# EAGLE design Multitaskr_Schematic (EAGLE 9.6.2)
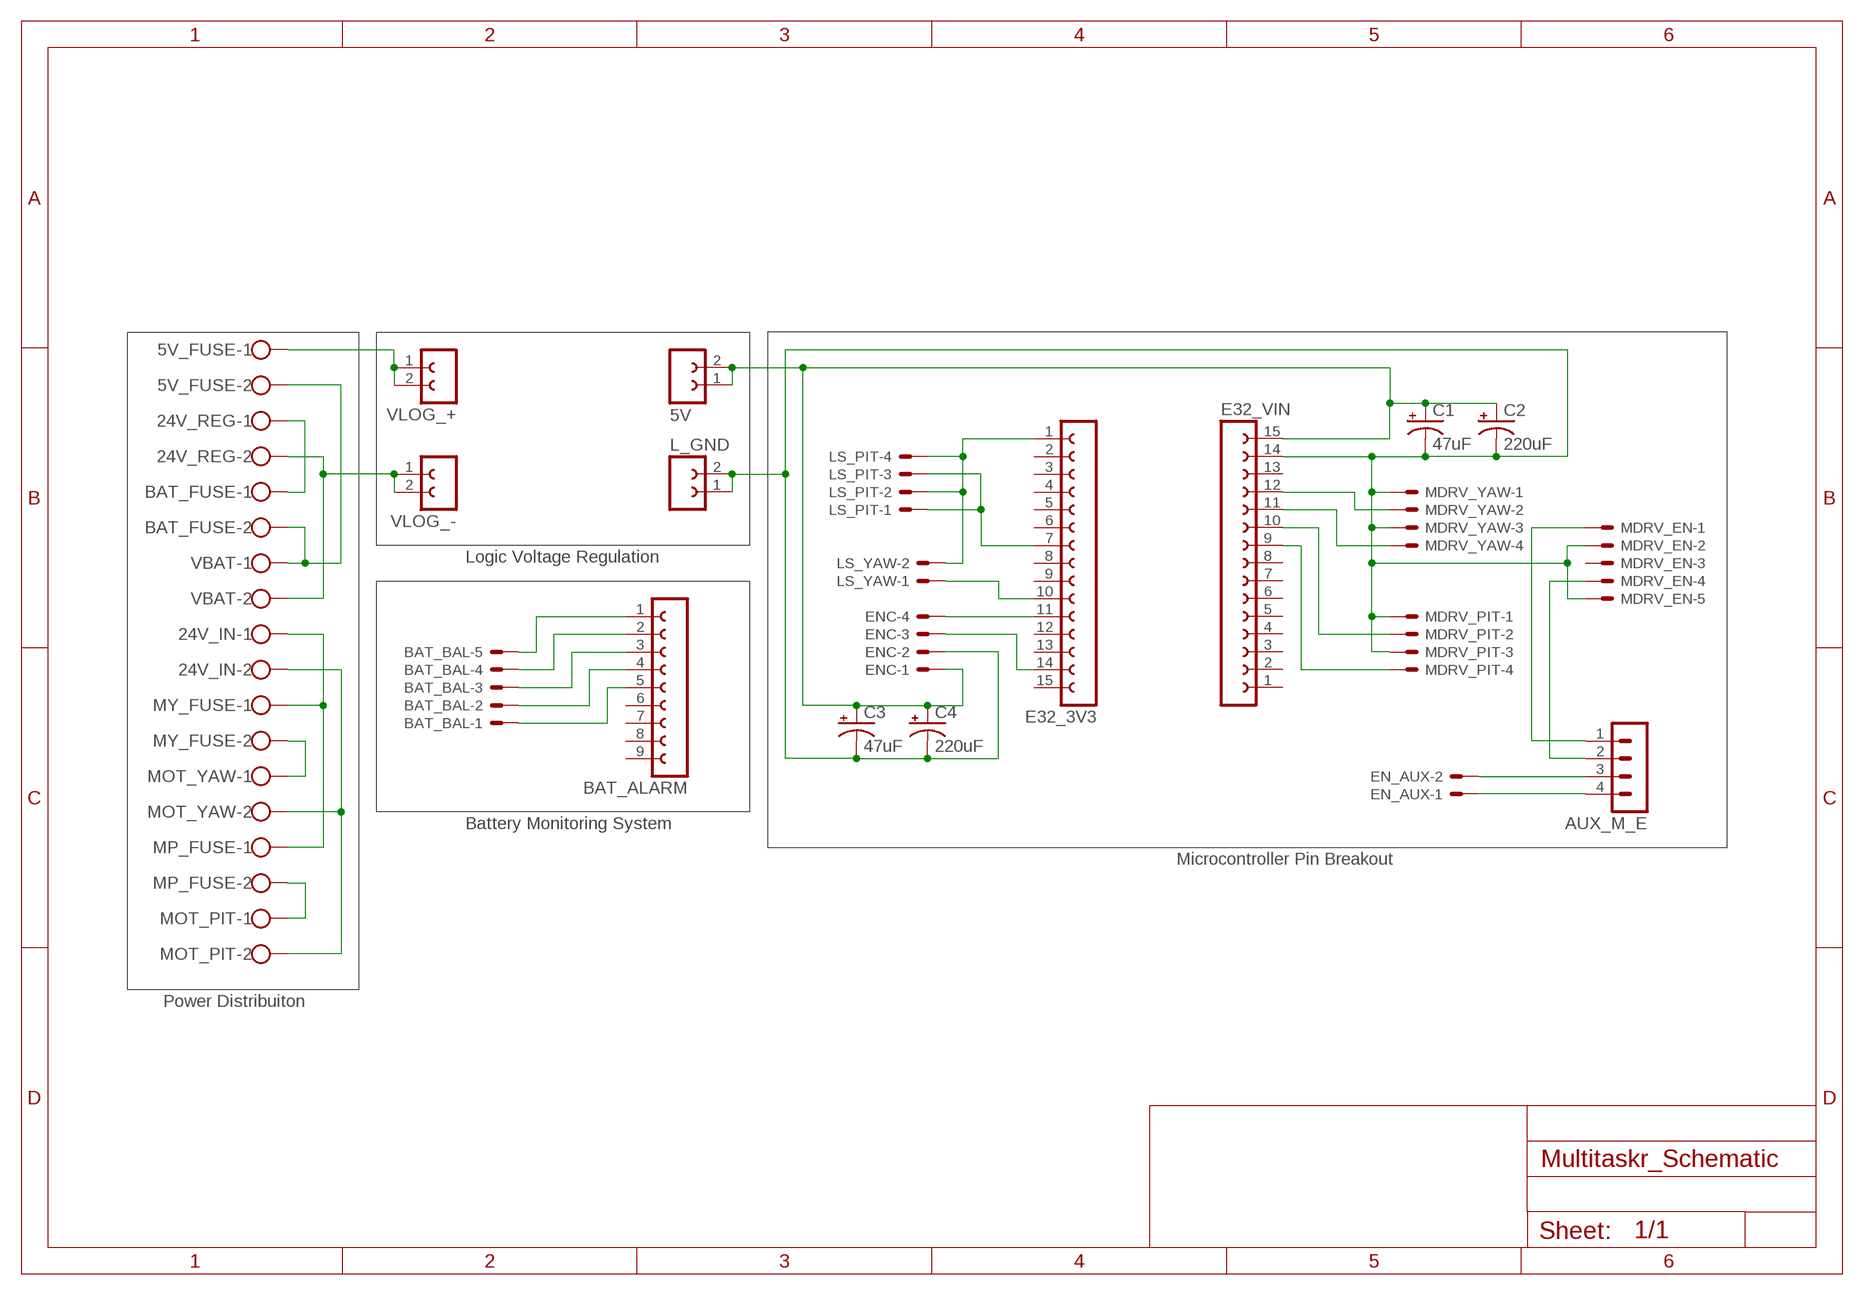
[diagram p0: schematic, sheet 1]

## Parts
5V  FE05-1  [FE05-1]
5V_FUSE  SCREW_TERMINAL  [FP_ST]
24V_IN  SCREW_TERMINAL  [FP_ST]
24V_REG  SCREW_TERMINAL  [FP_ST]
AUX_M_E  MA04-1  [MA04-1]
BAT_ALARM  FE09-1  [FE09]
BAT_BAL  JST-XH-05-PIN-ROUND-PAD  [JST-XH-05-PACKAGE-ROUND-PAD]
BAT_FUSE  SCREW_TERMINAL  [FP_ST]
C1  47uF  CPOL-USE2.5-7  [E2,5-7]
C2  220uF  CPOL-USE2.5-4V  [E2,5RE]
C3  47uF  CPOL-USE2.5-4V  [E2,5RE]
C4  220uF  CPOL-USE2.5-7  [E2,5-7]
E32_3V3  FE15-1  [FE15]
E32_VIN  FE15-1  [FE15]
EN_AUX  JST-XH-02-PIN-ROUND-PAD  [JST-XH-02-PACKAGE-ROUND-PAD]
ENC  JST-XH-04-PIN-ROUND-PAD  [JST-XH-04-PACKAGE-ROUND-PAD]
L_GND  FE05-1  [FE05-1]
LS_PIT  JST-XH-04-PIN-ROUND-PAD  [JST-XH-04-PACKAGE-ROUND-PAD]
LS_YAW  JST-XH-02-PIN-ROUND-PAD  [JST-XH-02-PACKAGE-ROUND-PAD]
MDRV_EN  JST-XH-05-PIN-ROUND-PAD  [JST-XH-05-PACKAGE-ROUND-PAD]
MDRV_PIT  JST-XH-04-PIN-ROUND-PAD  [JST-XH-04-PACKAGE-ROUND-PAD]
MDRV_YAW  JST-XH-04-PIN-ROUND-PAD  [JST-XH-04-PACKAGE-ROUND-PAD]
MOT_PIT  SCREW_TERMINAL  [FP_ST]
MOT_YAW  SCREW_TERMINAL  [FP_ST]
MP_FUSE  SCREW_TERMINAL  [FP_ST]
MY_FUSE  SCREW_TERMINAL  [FP_ST]
VBAT  SCREW_TERMINAL  [FP_ST]
VLOG_+  FE05-1  [FE05-1]
VLOG_-  FE05-1  [FE05-1]

## Nets
1S: BAT_ALARM.2 BAT_BAL.4
2S: BAT_ALARM.3 BAT_BAL.3
3S: BAT_ALARM.4 BAT_BAL.2
3V3: E32_3V3.1 LS_PIT.2 LS_PIT.4 LS_YAW.2
4S: BAT_ALARM.5 BAT_BAL.1
5V: 5V.1 5V.2 C1.+ C2.+ C3.+ C4.+ E32_VIN.15 ENC.1
24V: 24V_IN.1 MP_FUSE.1 MY_FUSE.1
-S: BAT_ALARM.1 BAT_BAL.5
BAT+: 5V_FUSE.2 BAT_FUSE.2 VBAT.1
BAT-: 24V_REG.2 VBAT.2 VLOG_-.1 VLOG_-.2
EN_DIR: AUX_M_E.4 EN_AUX.1
EN_PGO: AUX_M_E.3 EN_AUX.2
ENA_MOT_PIT: AUX_M_E.1 MDRV_EN.1
ENA_MOT_Y: AUX_M_E.2 MDRV_EN.4
ESP_SCL: E32_3V3.14 ENC.3
ESP_SDA: E32_3V3.11 ENC.4
FUSE_P: MOT_PIT.1 MP_FUSE.2
FUSE_REG: 24V_REG.1 BAT_FUSE.1
FUSE_Y: MOT_YAW.1 MY_FUSE.2
L_GND: C1.- C2.- C3.- C4.- E32_VIN.14 ENC.2 L_GND.1 L_GND.2 MDRV_EN.2 MDRV_EN.5 MDRV_PIT.1 MDRV_PIT.3 MDRV_YAW.1 MDRV_YAW.3
LS_PITCH: E32_3V3.7 LS_PIT.1 LS_PIT.3
LS_YAW: E32_3V3.10 LS_YAW.1
LV+: 5V_FUSE.1 VLOG_+.1 VLOG_+.2
M_GND: 24V_IN.2 MOT_PIT.2 MOT_YAW.2
PITCH_DIR: E32_VIN.10 MDRV_PIT.2
PITCH_PUL: E32_VIN.9 MDRV_PIT.4
YAW_DIR: E32_VIN.12 MDRV_YAW.2
YAW_PUL: E32_VIN.11 MDRV_YAW.4
Unconnected: BAT_ALARM.6 BAT_ALARM.7 BAT_ALARM.8 BAT_ALARM.9 E32_3V3.2 E32_3V3.3 E32_3V3.4 E32_3V3.5 E32_3V3.6 E32_3V3.8 E32_3V3.9 E32_3V3.12 E32_3V3.13 E32_3V3.15 E32_VIN.1 E32_VIN.2 E32_VIN.3 E32_VIN.4 E32_VIN.5 E32_VIN.6 E32_VIN.7 E32_VIN.8 E32_VIN.13 MDRV_EN.3

## Notes on the sheet
- Logic Voltage Regulation
- Battery Monitoring System
- Microcontroller Pin Breakout
- Power Distribuiton

## Library data of the parts
5V L_GND VLOG_+ VLOG_- = headers:FE05-1: FEMALE HEADER; OC_FARNELL: unknown; OC_NEWARK: unknown
5V_FUSE 24V_IN 24V_REG BAT_FUSE MOT_PIT MOT_YAW MP_FUSE MY_FUSE VBAT = Screw-Terminal:SCREW_TERMINAL: WAGO SCREW CLAMP; MPN: 237-102; OC_FARNELL: unknown; OC_NEWARK: 70K9898
AUX_M_E = con-lstb:MA04-1: PIN HEADER; OC_FARNELL: unknown; OC_NEWARK: unknown
BAT_ALARM = con-lsta:FE09-1: FEMALE HEADER; OC_FARNELL: unknown; OC_NEWARK: unknown
BAT_BAL MDRV_EN = JST XH_V2:JST-XH-05-PIN: JST XH Connector 2 Pin Wire to board connector. Pitch: 2,54 mm, (0.100") Number of pins: 5 Created by Rembrandt Electronics www.rembrandtelectronics.com
C1-C4 = rcl:CPOL-US: POLARIZED CAPACITOR, American symbol; SPICEPREFIX: C
E32_3V3 E32_VIN = con-lsta:FE15-1: FEMALE HEADER; OC_FARNELL: unknown; OC_NEWARK: unknown
EN_AUX LS_YAW = JST XH_V2:JST-XH-02-PIN: JST XH Connector 2 Pin Wire to board connector. Pitch: 2,54 mm, (0.100") Number of pins: 2 Created by Rembrandt Electronics www.rembrandtelectronics.com
ENC LS_PIT MDRV_PIT MDRV_YAW = JST XH_V2:JST-XH-04-PIN: JST XH Connector 2 Pin Wire to board connector. Pitch: 2,54 mm, (0.100") Number of pins: 4 Created by Rembrandt Electronics www.rembrandtelectronics.com

## Module POWER_DISTRIBUITON
Ports: 

### Library data of the parts

## Board
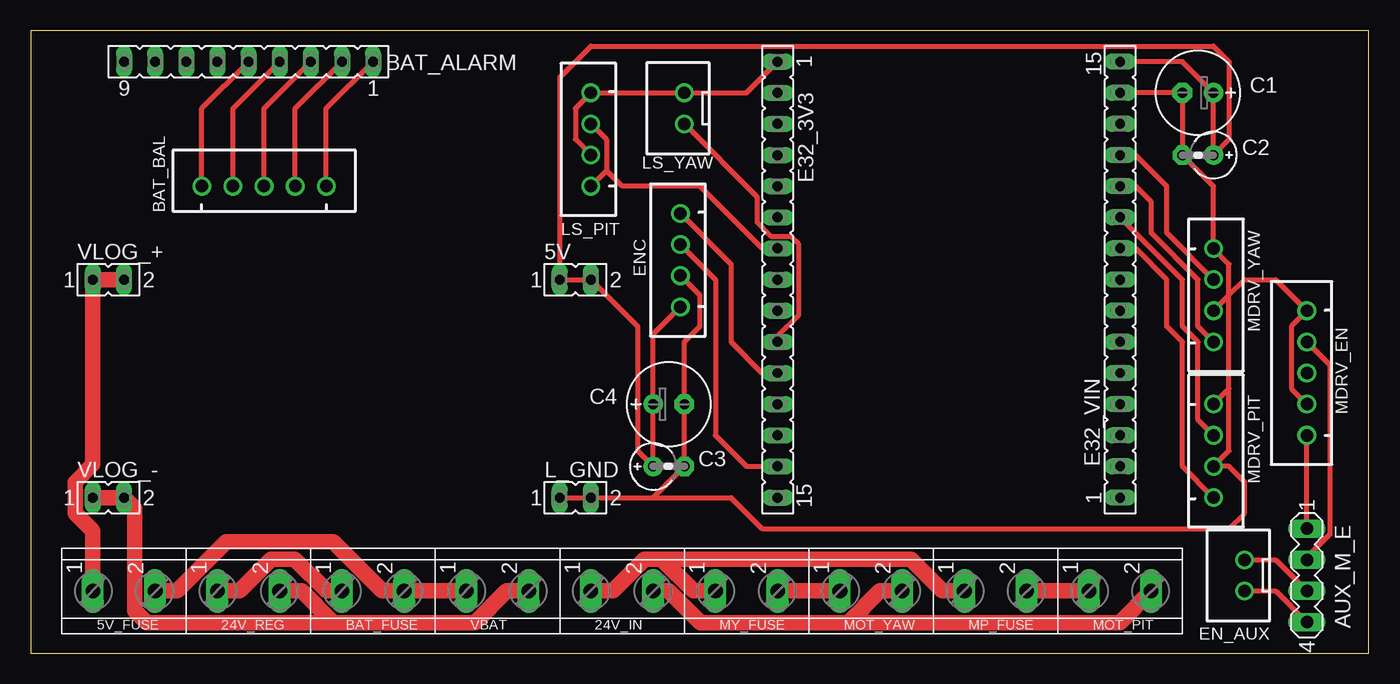
[diagram p1: board, top side]

Size 109.2 x 50.79 mm. Coordinates in mm from the lower left corner, seen from the top.
Outline: 0,0 109.2,0 109.2,50.79 0,50.79 0,0
Copper layers (1*16): Top 0.035mm / dielectric 1.5mm / Bottom 0.035mm
Design rules "default": minimum track width 6mil, minimum drill 0.35mm, track to track 6mil, track to pad 6mil, pad to pad 6mil, via to via 6mil, smd to smd 6mil, copper to edge 40mil, drill to drill 6mil, minimum pad ring 10mil, minimum via ring 8mil, stop-mask expansion 4mil, vias tented up to drill 0mil, thermal gap 10mil

### Footprints (pad centres in the part's own frame; a part is rotated, then mirrored left to right if it is on the bottom)
FE05-1 = drill 0.813 long: 1 -1.27,0; 2 1.27,0
FP_ST = drill 1.194 long: 1 -2.54,0; 2 2.54,0
MA04-1 = drill 1.016 long: 1 -3.81,0; 2 -1.27,0; 3 1.27,0; 4 3.81,0
FE09 = drill 0.813 long: 1 -10.16,0; 2 -7.62,0; 3 -5.08,0; 4 -2.54,0; 5 0,0; 6 2.54,0; 7 5.08,0; 8 7.62,0; 9 10.16,0
JST-XH-05-PACKAGE-ROUND-PAD = drill 1.016: 1 -5.08,0; 2 -2.54,0; 3 0,0; 4 2.54,0; 5 5.08,0
E2,5-7 = drill 0.813 pad 1.6: + -1.27,0 | drill 0.813 pad 1.6 octagon: - 1.27,0
E2,5RE = drill 0.813 pad 1.575: + -1.27,0 | drill 0.813 pad 1.575 octagon: - 1.27,0
FE15 = drill 0.813 long: 1 -17.78,0; 2 -15.24,0; 3 -12.7,0; 4 -10.16,0; 5 -7.62,0; 6 -5.08,0; 7 -2.54,0; 8 0,0; 9 2.54,0; 10 5.08,0; 11 7.62,0; 12 10.16,0; 13 12.7,0; 14 15.24,0; 15 17.78,0
JST-XH-02-PACKAGE-ROUND-PAD = drill 1.016: 1 0,0; 2 2.54,0
JST-XH-04-PACKAGE-ROUND-PAD = drill 1.016: 1 -2.54,0; 2 0,0; 3 2.54,0; 4 5.08,0

### Placement (x,y rotation side)
5V  44.45,30.48 0 top
5V_FUSE  7.62,5.08 0 top
24V_IN  48.26,5.08 0 top
24V_REG  17.78,5.08 0 top
AUX_M_E  104.14,6.35 270 top
BAT_ALARM  17.78,48.26 180 top
BAT_BAL  19.05,38.1 0 top
BAT_FUSE  27.94,5.08 0 top
C1  95.25,45.72 180 top
C2  95.25,40.64 180 top
C3  52.07,15.24 0 top
C4  52.07,20.32 0 top
E32_3V3  60.96,30.48 270 top
E32_VIN  88.9,30.48 90 top
EN_AUX  99.06,5.08 90 top
ENC  53.02,30.8 90 top
L_GND  44.45,12.7 0 top
LS_PIT  45.72,40.64 90 top
LS_YAW  53.34,43.18 90 top
MDRV_EN  104.14,22.86 90 top
MDRV_PIT  96.52,17.78 270 top
MDRV_YAW  96.52,30.48 270 top
MOT_PIT  88.9,5.08 0 top
MOT_YAW  68.58,5.08 0 top
MP_FUSE  78.74,5.08 0 top
MY_FUSE  58.42,5.08 0 top
VBAT  38.1,5.08 0 top
VLOG_+  6.35,30.48 0 top
VLOG_-  6.35,12.7 0 top

### Tracks (layer width: path | path; a pad name or v marks a point on that pad's centre or on a via)
1S
  Top 0.406: BAT_BAL.4 21.59,44.45 BAT_ALARM.2
2S
  Top 0.406: BAT_BAL.3 19.05,44.45 BAT_ALARM.3
3S
  Top 0.406: BAT_BAL.2 16.51,44.45 BAT_ALARM.4
3V3
  Top 0.406: E32_3V3.1 58.42,45.72 LS_YAW.2 LS_PIT.4 44.45,44.45 44.45,41.91 LS_PIT.2
4S
  Top 0.406: BAT_BAL.1 13.97,44.45 BAT_ALARM.5
5V
  Top 0.406: E32_VIN.15 93.98,48.26 C1.+ C2.+ 97.79,41.91 97.79,48.26 96.52,49.53 45.72,49.53 43.18,46.99 5V.1 5V.2 49.53,26.67 49.53,16.51 C3.+ C4.+ 50.8,26.04 ENC.1
24V
  Top 1.27: 51.5,7.66 50.1,7.66 47.52,5.08 24V_IN.1 | MY_FUSE.1 54.07,5.08 51.5,7.66 | MP_FUSE.1 74.4,5.08 71.82,7.66 51.5,7.66
-S
  Top 0.406: BAT_BAL.5 24.13,44.45 BAT_ALARM.1
BAT+
  Top 1.27: BAT_FUSE.2 VBAT.1 28.68,5.08 24.68,9.08 15.96,9.08 11.96,5.08 5V_FUSE.2
BAT-
  Top 1.27: VBAT.2 38.84,5.08 36.26,2.5 24.7,2.5 | 24V_REG.2 22.12,5.08 24.7,2.5 | 24.7,2.5 9.46,2.5 8.48,3.49 8.48,11.84 VLOG_-.2 VLOG_-.1
EN_DIR
  Top 0.406: EN_AUX.1 101.6,5.08 AUX_M_E.4
EN_PGO
  Top 0.406: EN_AUX.2 101.6,7.62 AUX_M_E.3
ENA_MOT_PIT
  Top 0.406: AUX_M_E.1 MDRV_EN.1
ENA_MOT_Y
  Top 0.406: AUX_M_E.2 104.14,7.82 106.02,9.7 106.02,23.52 MDRV_EN.4
ESP_SCL
  Top 0.406: ENC.3 55.88,30.48 55.88,17.78 58.42,15.24 E32_3V3.14
ESP_SDA
  Top 0.406: ENC.4 57.15,31.75 57.15,25.4 59.69,22.86 E32_3V3.11
FUSE_P
  Top 1.27: MP_FUSE.2 MOT_PIT.1
FUSE_REG
  Top 1.27: BAT_FUSE.1 24.14,5.08 21.56,7.66 19.62,7.66 17.05,5.08 24V_REG.1
FUSE_Y
  Top 1.27: MY_FUSE.2 MOT_YAW.1
L_GND
  Top 0.406: L_GND.1 L_GND.2 | E32_VIN.14 C1.- C2.- 96.52,38.1 MDRV_YAW.1 97.79,31.75 97.79,29.21 | MDRV_YAW.3 97.79,29.21 | MDRV_PIT.1 97.79,21.59 | 97.79,21.59 97.79,29.21 | 97.79,21.59 97.79,16.51 MDRV_PIT.3 97.79,15.24 99.06,13.97 99.06,11.43 97.79,10.16 59.69,10.16 57.15,12.7 L_GND.2 | ENC.2 54.61,29.21 54.61,26.67 53.34,25.4 C4.- C3.- 50.8,12.7 L_GND.2 | 97.79,29.21 99.06,30.48 101.6,30.48 MDRV_EN.5 102.87,26.67 102.87,21.59 MDRV_EN.2
LS_PITCH
  Top 0.406: E32_3V3.7 59.69,33.02 54.61,38.1 48.26,38.1 46.99,39.37 | LS_PIT.3 46.99,41.91 46.99,39.37 | 46.99,39.37 LS_PIT.1
LS_YAW
  Top 0.406: LS_YAW.1 59.28,37.24 59.28,35.14 60.39,34.04 62.04,34.04 62.64,33.44 62.64,27.52 60.96,25.84 E32_3V3.10
LV+
  Top 1.27: 5V_FUSE.1 5.08,9.99 3.63,11.44 3.63,13.96 5.08,15.41 VLOG_+.1 VLOG_+.2
M_GND
  Top 1.27: 24V_IN.2 52.06,5.08 54.64,2.5 66.74,2.5 | MOT_YAW.2 69.32,5.08 66.74,2.5 | MOT_PIT.2 88.86,2.5 66.74,2.5
PITCH_DIR
  Top 0.406: MDRV_PIT.2 95.25,19.05 95.25,25.4 93.98,26.67 93.98,30.48 E32_VIN.10
PITCH_PUL
  Top 0.406: MDRV_PIT.4 93.98,15.24 93.98,25.4 92.71,26.67 92.71,30.48 90.17,33.02 E32_VIN.9
YAW_DIR
  Top 0.406: MDRV_YAW.2 92.71,34.29 92.71,38.1 90.17,40.64 E32_VIN.12
YAW_PUL
  Top 0.406: MDRV_YAW.4 95.25,26.67 95.25,30.48 91.44,34.29 91.44,36.83 90.17,38.1 E32_VIN.11